# EAGLE schematic EndEffector (EAGLE 6.5.0)
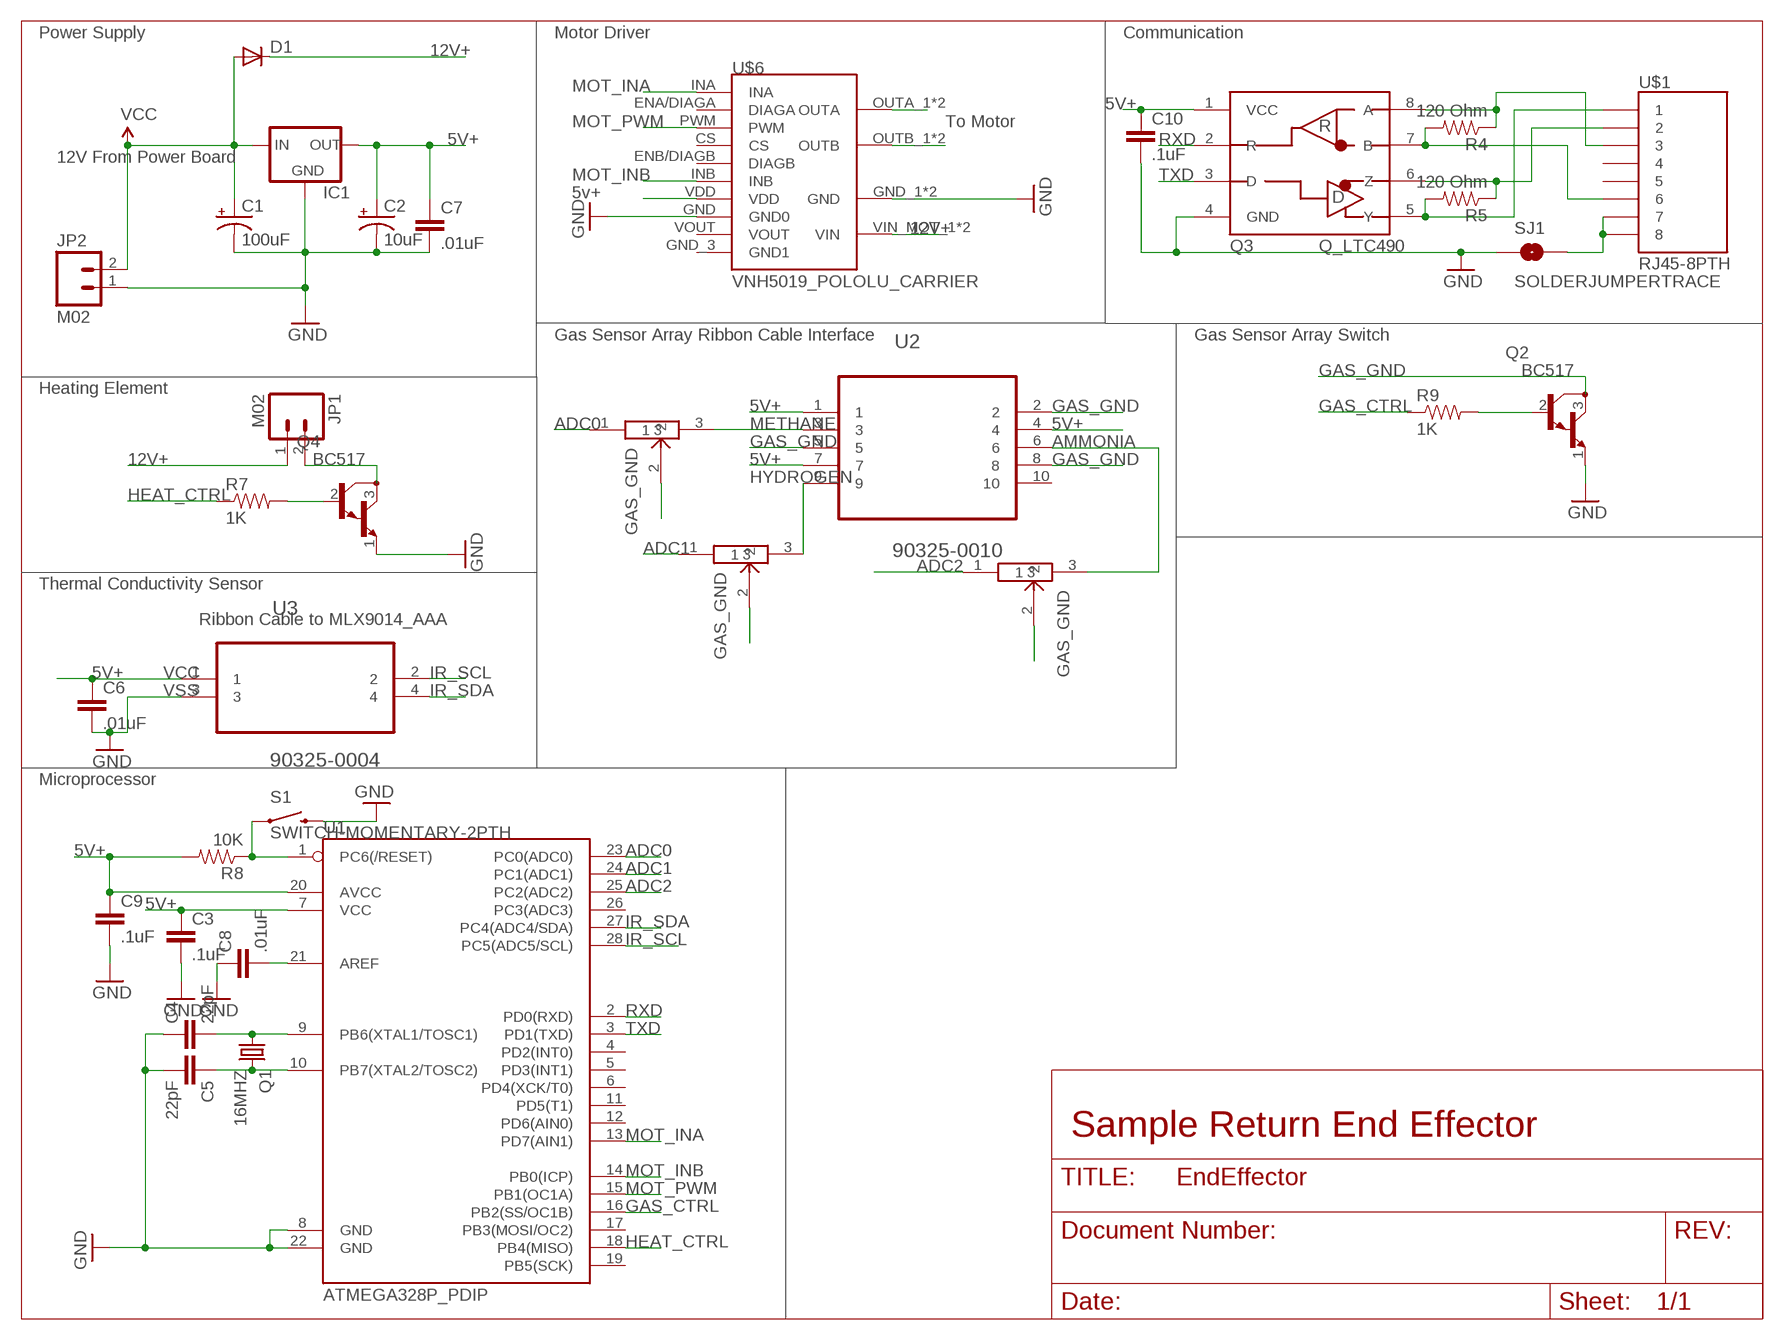
[diagram p0: schematic, sheet 1]

## Parts
C1  100uF  CAP_POLPTH1  [CPOL-RADIAL-100UF-25V]
C2  10uF  CAP_POLPTH2  [CPOL-RADIAL-10UF-25V]
C3  .1uF  CAPKIT  [CAP-PTH-SMALL-KIT]
C4  22pF  CAPKIT  [CAP-PTH-SMALL-KIT]
C5  22pF  CAPKIT  [CAP-PTH-SMALL-KIT]
C6  .01uF  CAPKIT  [CAP-PTH-SMALL-KIT]
C7  .01uF  CAPKIT  [CAP-PTH-SMALL-KIT]
C8  .01uF  CAPKIT  [CAP-PTH-SMALL-KIT]
C9  .1uF  CAPKIT  [CAP-PTH-SMALL-KIT]
C10  .1uF  CAPKIT  [CAP-PTH-SMALL-KIT]
D1  DIODEPTH  [DIODE-1N4001]
IC1  V_REG_78XXSINK  [TO220-IGO]
JP1  M02  M02POGO_PIN_HOLES_ONLY  [1X02_PP_HOLES_ONLY]
JP2  M02  M02POGO_PIN_HOLES_ONLY  [1X02_PP_HOLES_ONLY]
Q1  16MHZ  CRYSTALHC49S  [HC49/S]
Q2  BC517  [TO92]
Q3  Q_LTC490  [DIP8]
Q4  BC517  [TO92]
R4  120 Ohm  RESISTORAXIAL-0.3  [AXIAL-0.3]
R5  120 Ohm  RESISTORAXIAL-0.3  [AXIAL-0.3]
R7  1K  RESISTORAXIAL-0.3  [AXIAL-0.3]
R8  10K  RESISTORAXIAL-0.3  [AXIAL-0.3]
R9  1K  RESISTORAXIAL-0.3  [AXIAL-0.3]
S1  SWITCH-MOMENTARY-2PTH  [TACTILE-PTH]
SJ1  SOLDERJUMPERTRACE  [SJ_2S-TRACE]
U1  ATMEGA328P_PDIP  [DIL28-3]
U2  90325-0010  [MOLEX_90325-0010]
U3  90325-0004  [MOLEX_90325-0004]
U$1  RJ45-8PTH  [RJ45-8]
U$2  POTENTIOMETER_BOURNS_3006P-1-104LF  [BOURNS30006_TRIMPOT]
U$4  POTENTIOMETER_BOURNS_3006P-1-104LF  [BOURNS30006_TRIMPOT]
U$5  POTENTIOMETER_BOURNS_3006P-1-104LF  [BOURNS30006_TRIMPOT]
U$6  VNH5019_POLOLU_CARRIER  [VNH5019_CARRIER]

## Nets
5V+: C2.1(+) C3.1 C6.1 C7.1 C9.1 C10.1 IC1.OUT Q3.1(VCC) R8.P$2 U1.7(VCC) U1.20(AVCC) U2.1 U2.4 U2.7 U3.1 U$6.VDD
12V+: D1.C JP1.1 U$6.VIN_MOT_1(VIN) U$6.VIN_MOT_2(VIN)
ADC0: U1.23(PC0(ADC0)) U$4.1
ADC1: U1.24(PC1(ADC1)) U$5.1
ADC2: U1.25(PC2(ADC2)) U$2.1
AMMONIA: U2.6 U$2.3
GAS_CTRL: R9.P$1 U1.16(PB2(SS/OC1B))
GAS_GND: Q2.3(C) U2.2 U2.5 U2.8 U$2.2 U$4.2 U$5.2
GND: C1.2(-) C2.2(-) C3.2 C4.1 C5.2 C6.2 C7.2 C8.1 C9.2 C10.2 IC1.GND JP2.1 Q2.1(E) Q3.4(GND) Q4.1(E) S1.3 SJ1.1 U1.8(GND) U1.22(GND) U3.3 U$6.GND(GND0) U$6.GND_1(GND) U$6.GND_2(GND)
HEAT_CTRL: R7.P$1 U1.18(PB4(MISO))
HYDROGEN: U2.9 U$5.3
IR_SCL: U1.28(PC5(ADC5/SCL)) U3.2
IR_SDA: U1.27(PC4(ADC4/SDA)) U3.4
METHANE: U2.3 U$4.3
MOT_INA: U1.13(PD7(AIN1)) U$6.INA
MOT_INB: U1.14(PB0(ICP)) U$6.INB
MOT_PWM: U1.15(PB1(OC1A)) U$6.PWM
N$1: JP1.2 Q4.3(C)
N$2: Q2.2(B) R9.P$2
N$3: U$6.OUTA_1(OUTA) U$6.OUTA_2(OUTA)
N$4: C5.1 Q1.2 U1.10(PB7(XTAL2/TOSC2))
N$5: Q3.5(Y) R5.P$2 U$1.1
N$7: C4.2 Q1.1 U1.9(PB6(XTAL1/TOSC1))
N$8: SJ1.2 U$1.7 U$1.8
N$9: Q3.6(Z) R5.P$1 U$1.2
N$10: Q3.7(B) R4.P$2 U$1.6
N$11: Q3.8(A) R4.P$1 U$1.3
N$13: R8.P$1 S1.1 U1.1(PC6(/RESET))
N$23: Q4.2(B) R7.P$2
N$27: U$6.OUTB_1(OUTB) U$6.OUTB_2(OUTB)
N$28: C8.2 U1.21(AREF)
RXD: Q3.2(R) U1.2(PD0(RXD))
TXD: Q3.3(D) U1.3(PD1(TXD))
VCC: C1.1(+) D1.A IC1.IN JP2.2
Unconnected: U1.4(PD2(INT0)) U1.5(PD3(INT1)) U1.6(PD4(XCK/T0)) U1.11(PD5(T1)) U1.12(PD6(AIN0)) U1.17(PB3(MOSI/OC2)) U1.19(PB5(SCK)) U1.26(PC3(ADC3)) U2.10 U$1.4 U$1.5 U$6.CS U$6.ENA/DIAGA(DIAGA) U$6.ENB/DIAGB(DIAGB) U$6.GND_3(GND1) U$6.VOUT

## Notes on the sheet
- Power Supply | Motor Driver | Communication
- 12V+
- MOT_INA
- MOT_PWM | To Motor
- 5V+ | RXD
- 12V From Power Board
- MOT_INB | TXD
- 5v+
- 12V+
- Gas Sensor Array Ribbon Cable Interface | Gas Sensor Array Switch
- Heating Element
- GAS_CTRL
- Thermal Conductivity Sensor
- Ribbon Cable to MLX9014_AAA
- 5V+ | VCC | IR_SCL
- VSS | IR_SDA
- Microprocessor
- 5V+ | ADC0
- ADC1
- ADC2
- IR_SDA
- IR_SCL
- RXD
- TXD
- MOT_INA | Sample Return End Effector
- MOT_INB
- MOT_PWM
- GAS_CTRL
- HEAT_CTRL

## Library data of the parts
C1 C2 = SparkFun-Capacitors:CAP_POL: Capacitor Polarized These are standard SMD and PTH capacitors. Normally 10uF, 47uF, and 100uF in electrolytic and tantalum varieties. Always verify the external diameter of the through hole cap, it varies with capacity, voltage, and manufacturer. The EIA devices should be standard.
C3-C10 = SparkFun-Capacitors:CAP: Capacitor Standard 0603 ceramic capacitor, and 0.1" leaded capacitor.
D1 = SparkFun-DiscreteSemi:DIODE: Diode These are standard reverse protection diodes and small signal diodes. SMA package can handle up to about 1A. SOD-323 can handle about 200mA. What the SOD-323 package when ordering, there are some mfgs out there that are 5-pin packages.
IC1 = SparkFun-PowerIC:V_REG_78XX: Voltage Regulator Standard 7805 5V regulator. IGO (Input Ground Output). Spark Fun Electronics SKU : COM-00107
JP1 JP2 = SparkFun-Connectors:M02: Standard 2-pin 0.1" header. Use with - straight break away headers ( PRT-00116) - right angle break away headers (PRT-00553) - swiss pins (PRT-00743) - machine pins (PRT-00117) - female headers (PRT-00115) Molex polarized connector foot print use with: PRT-08233 with associated crimp pins and housings. 2.54_SCREWTERM for use with PRT-10571. 3.5mm Screw Terminal footprints for PRT-08084 5mm Screw Terminal footprints for use with PRT-08433
Q1 = crystal:CRYSTAL: CRYSTAL; OC_FARNELL: 1667008; OC_NEWARK: unknown
Q2 Q4 = transistor-npn:BC517*: NPN Darlington Transistor
Q3 = PCB0M1:Q_LTC490: IC, RS422-RS485 DRVR
R4 R5 R7-R9 = SparkFun-Passives:RESISTOR: Resistor Basic schematic elements and footprints for 0603, 1206, and PTH resistors.
S1 = SparkFun-Electromechanical:SWITCH-MOMENTARY-2: Various NO switches- pushbuttons, reed, etc
SJ1 = SparkFun-Passives:SOLDERJUMPER: Solder Jumper Standard SMD solder jumper. Used to automate production. Two varients : Normally Open and Normally Closed are the same, but have different paste layers. NC will have a large amount of paste and should jumper during reflow.
U1 = SparkFun-DigitalIC:ATMEGA328P_PDIP: uC used in the Arduino 32kb flash, 1k EEPROM, 2k SRAM This is the through-hole version of this chip.
U2 = Molex_By_element14_Batch_1:90325-0010: HEADER; MPN: 90325-0010; OC_FARNELL: 673249; OC_NEWARK: 46WX961; PACKAGE: HEADER, 1.27MM, 10 WAY; SUPPLIER: Molex
U3 = Molex_By_element14_Batch_1:90325-0004: HEADER; MPN: 90325-0004; OC_FARNELL: 673213; OC_NEWARK: 46WX958; PACKAGE: HEADER, 1.27MM, 4 WAY; SUPPLIER: Molex
U$1 = SparkFun-Connectors:RJ45-8: RJ45 Jack Simple RJ45, 8-pin connection - connector for common Cat5, Cat5e, and Cat6 Ethernet cables. Footprint not yet proven in production. Connector sku is PRT-00643; Breakout PCB sku is BOB-00716.
U$2 U$4 U$5 = SampleReturnParts:POTENTIOMETER_BOURNS_3006P-1-104LF: BOURNS 3006P-1-104LF TRIMMER, POTENTIOMETER No. of Turns: 15 Potentiometer Mounting: Through Hole Power Rating: 750 mW Resistance Tolerance: ± 10% SVHC: No SVHC (20-Jun-2013) Temperature Coefficient: ± 100ppm/°C Track Resistance: 100 kohm Newark Part 32K7294
U$6 = SampleReturnParts:VNH5019_POLOLU_CARRIER